# Altium schematic sheet Схема сборки опытный.SchDoc
size 420 x 297 mm; Address1: Address1; Address2: Address2; Address3: Address3; Address4: Address4; DocumentNumber: АБВГ.123456.001 Э3; SheetNumber: 3; SheetTotal: 5; Scale: 1:1; DocumentType: Схема электрическая принципиальная; FirstReferrence: АБВГ.123456.001
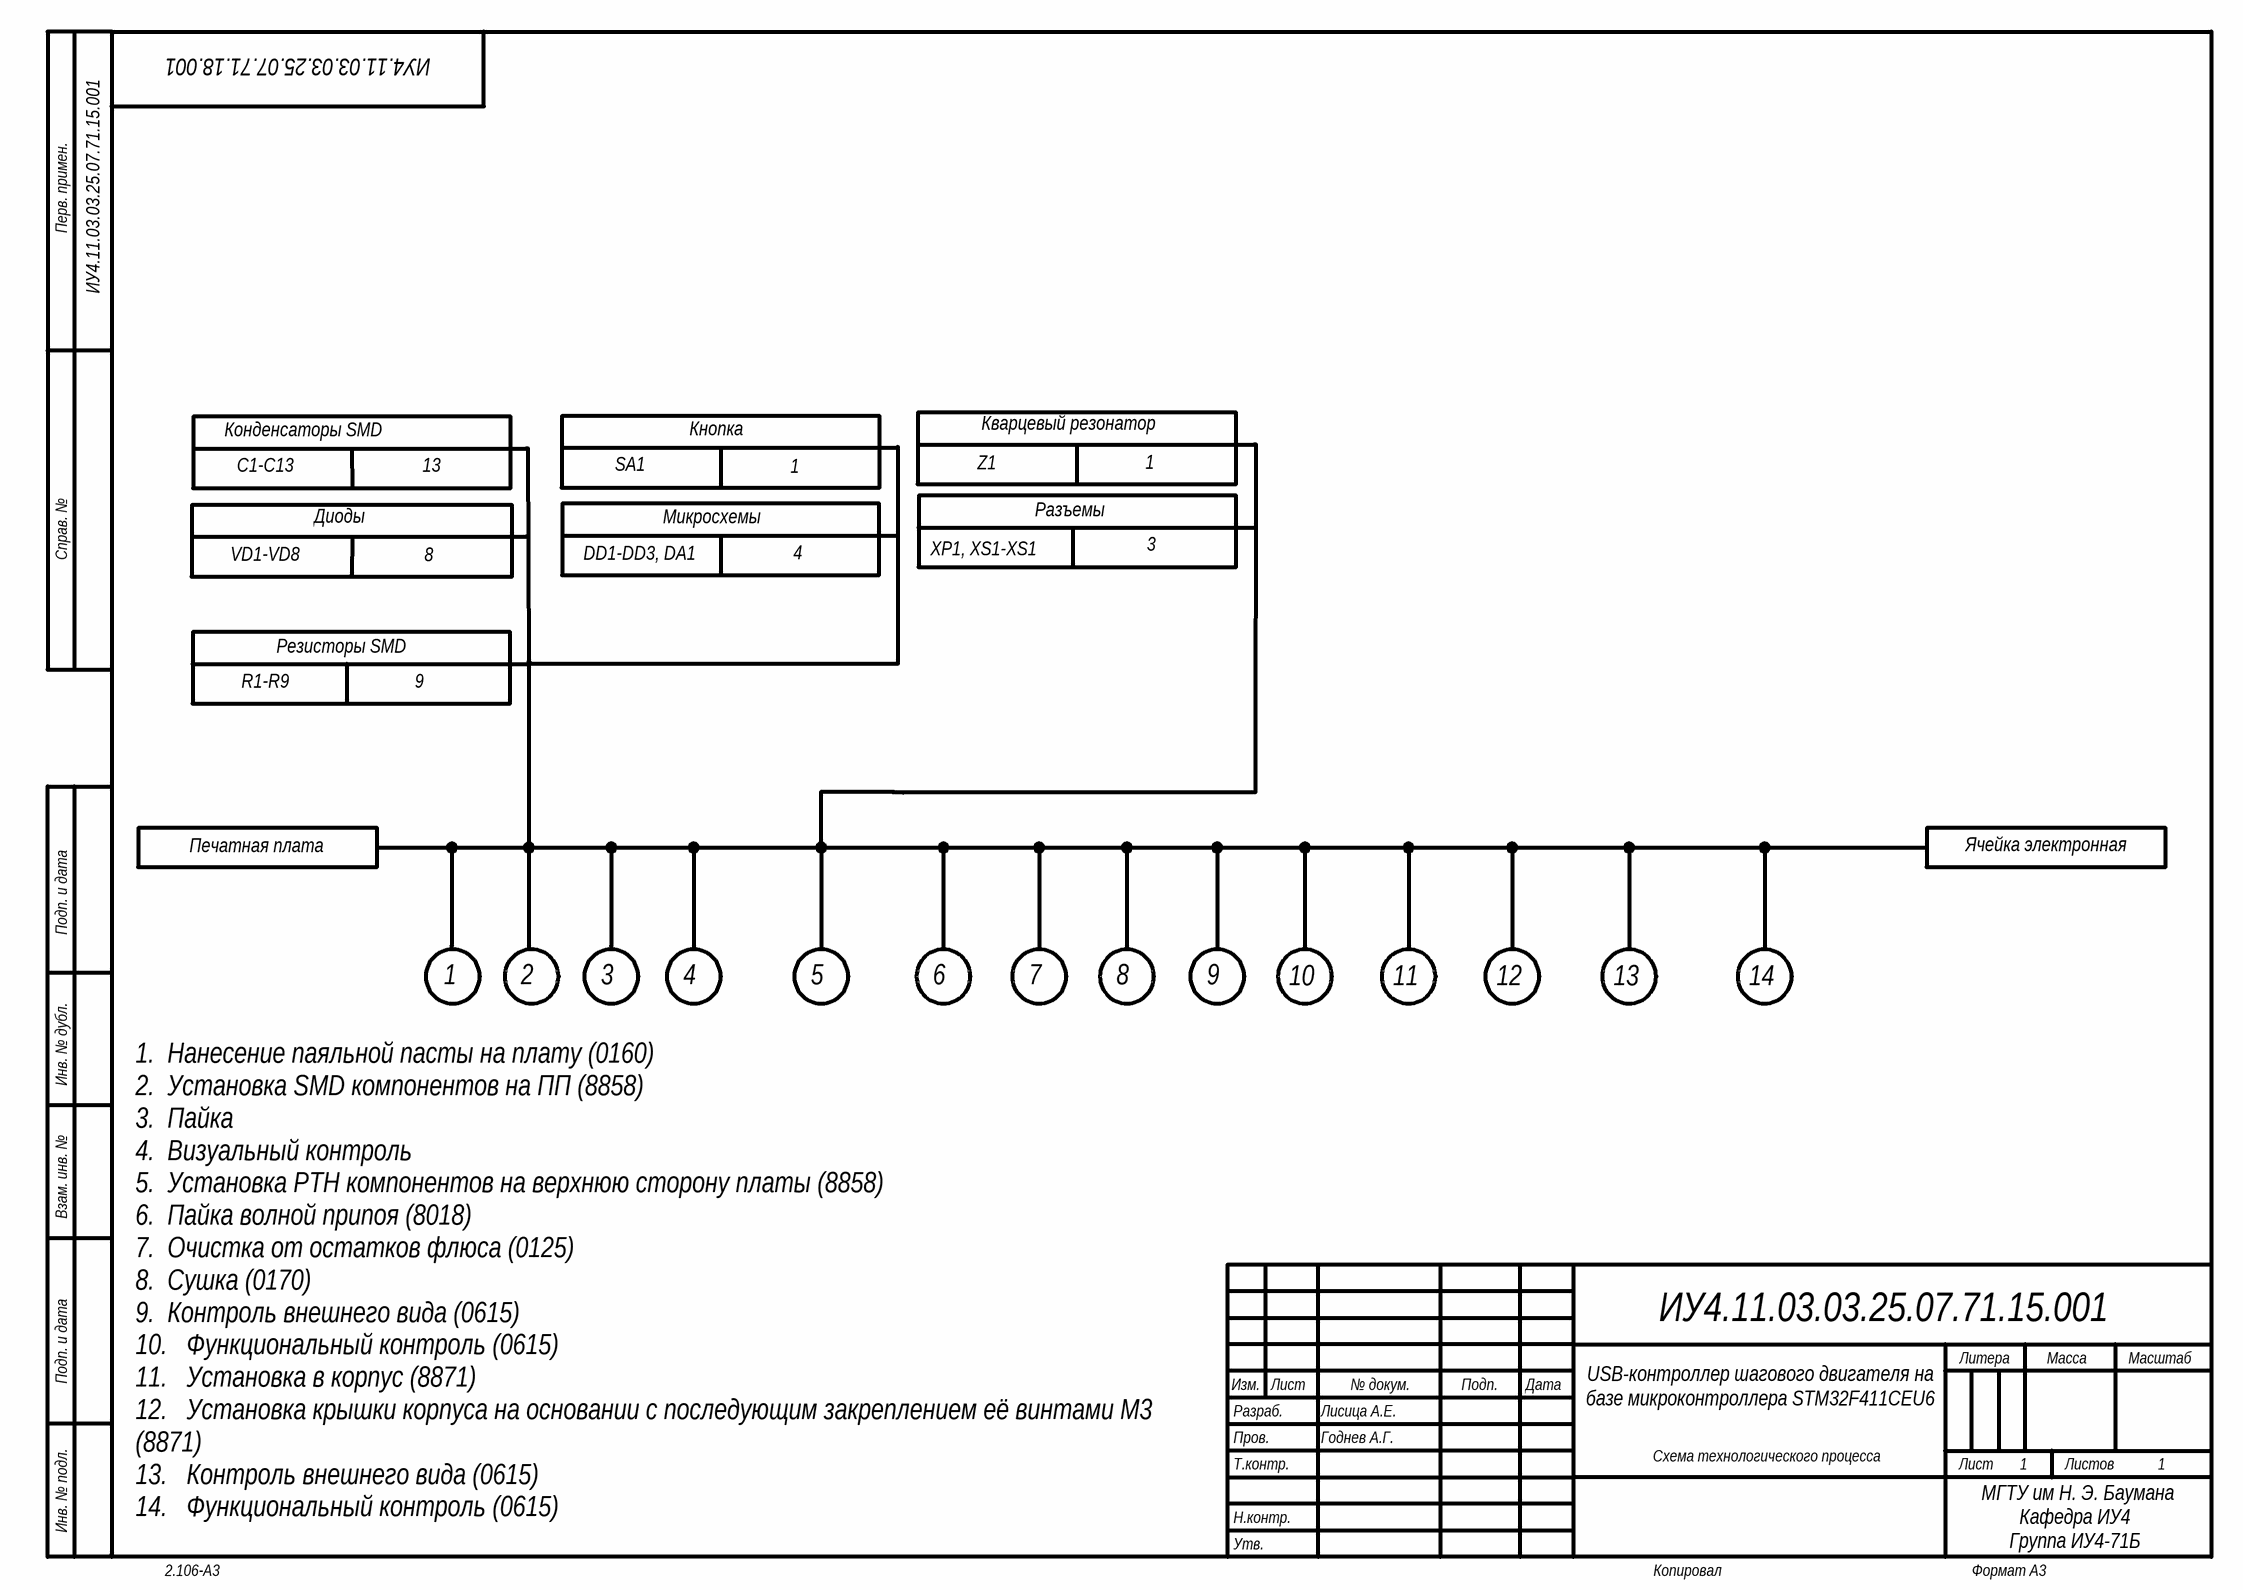
[diagram p0: Схема сборки опытный.SchDoc]

## Notes on the sheet
- ИУ4.11.03.03.25.07.71.18.001
- ИУ4.11.03.03.25.07.71.15.001
- Перв. примен.
- Конденсаторы SMD
- Кнопка
- Кварцевый резонатор
- C1-C13
- Диоды
- 13
- SA1
- Микросхемы
- 1
- Z1
- Разъемы
- Справ. №
- VD1-VD8
- 8
- DD1-DD3, DA1
- 4
- XP1, XS1-XS1
- 3
- Резисторы SMD
- R1-R9
- 9
- Печатная плата
- Ячейка электронная
- Подп. и дата
- 2
- 5
- 6
- 7
- 10
- 11
- 12
- 14
- Инв. № дубл.
- Взам. инв. №
- Разраб.
- Изм.
- Лист
- Лисица А.Е.
- № докум.
- Подп.
- Дата
- Литера
- Масса
- Масштаб
- Пров.
- Т.контр.
- Годнев А.Г.
- USB-контроллер шагового двигателя на базе микроконтроллера STM32F411CEU6
- Схема технологического процесса
- Листов
- Инв. № подл.
- 1.  Нанесение паяльной пасты на плату (0160)
  2.  Установка SMD компонентов на ПП (8858)
  3.  Пайка
  4.  Визуальный контроль
  5.  Установка PTH компонентов на верхнюю сторону платы (8858)
  6.  Пайка волной припоя (8018)
  7.  Очистка от остатков флюса (0125)
  8.  Сушка (0170)
  9.  Контроль внешнего вида (0615)
  10.   Функциональный контроль (0615)
  11.   Установка в корпус (8871)
  12.   Установка крышки корпуса на основании с последующим закреплением её винтами М3 (8871)
  13.   Контроль внешнего вида (0615)
  14.   Функциональный контроль (0615)
- Утв.
- Н.контр.
- Группа ИУ4-71Б
- Кафедра ИУ4
- МГТУ им Н. Э. Баумана
- 2.106-A3
- Копировал
- Формат А3